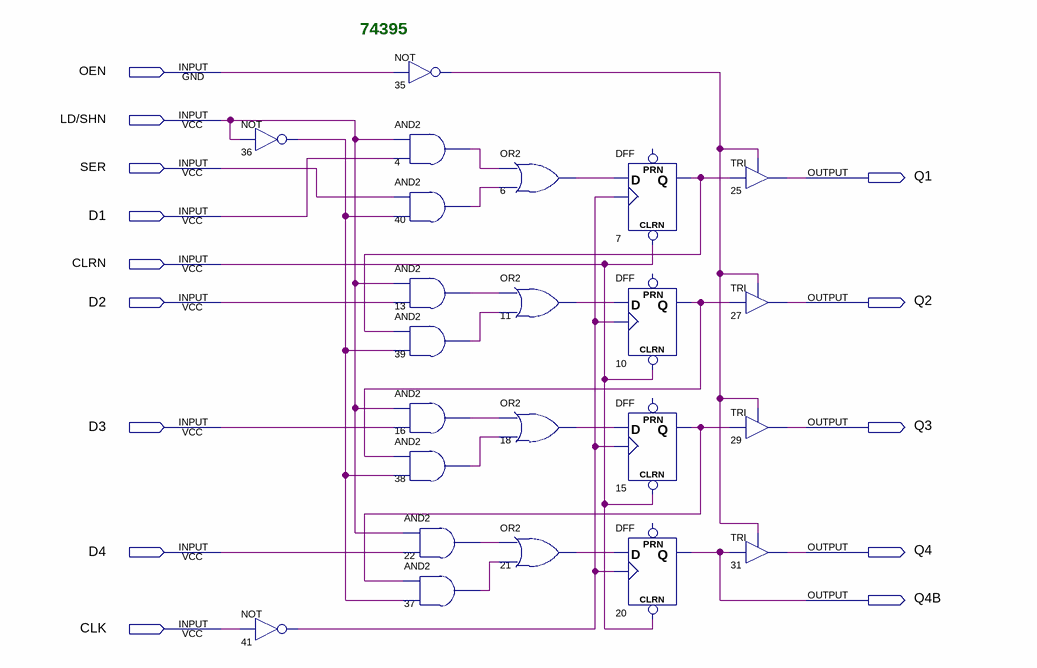
[diagram p0: schematic sheet]
// Quartus schematic 74395.bdf as structural Verilog: 23 symbols, 14 pins
module \74395  (
  input  OEN,
  input  \LD/SHN ,
  input  SER,
  input  D1,
  input  CLRN,
  input  D2,
  input  D3,
  input  D4,
  input  CLK,
  output Q1,
  output Q2,
  output Q3,
  output Q4,
  output Q4B
);

  wire n4_out, n6_out, n7_q, n10_q, n11_out, n13_out, n15_q, n16_out, n18_out, n21_out, n22_out, n35_out,
       n36_out, n37_out, n38_out, n39_out, n40_out, n41_out;

  not u_36 (n36_out, \LD/SHN );
  not u_41 (n41_out, CLK);
  not u_35 (n35_out, OEN);
  and u_4 (n4_out, \LD/SHN , D1);
  and u_40 (n40_out, SER, n36_out);
  and u_13 (n13_out, \LD/SHN , D2);
  and u_39 (n39_out, n7_q, n36_out);
  and u_16 (n16_out, \LD/SHN , D3);
  and u_38 (n38_out, n10_q, n36_out);
  and u_22 (n22_out, \LD/SHN , D4);
  and u_37 (n37_out, n15_q, n36_out);
  or u_6 (n6_out, n4_out, n40_out);
  or u_11 (n11_out, n13_out, n39_out);
  or u_18 (n18_out, n16_out, n38_out);
  or u_21 (n21_out, n22_out, n37_out);
  DFF u_7 (.CLRN(CLRN), .CLK(n41_out), .D(n6_out), .Q(n7_q));  // open: PRN
  DFF u_10 (.CLRN(CLRN), .CLK(n41_out), .D(n11_out), .Q(n10_q));  // open: PRN
  DFF u_15 (.CLRN(CLRN), .CLK(n41_out), .D(n18_out), .Q(n15_q));  // open: PRN
  DFF u_20 (.CLRN(CLRN), .CLK(n41_out), .D(n21_out), .Q(Q4B));  // open: PRN
  TRI u_25 (.IN(n7_q), .OE(n35_out), .OUT(Q1));
  TRI u_27 (.IN(n10_q), .OE(n35_out), .OUT(Q2));
  TRI u_29 (.IN(n15_q), .OE(n35_out), .OUT(Q3));
  TRI u_31 (.IN(Q4B), .OE(n35_out), .OUT(Q4));

  // Notes on the sheet:
  //   74395
endmodule
